# EAGLE design esp8266-hw7 (EAGLE 9.3.1)
ESP8266 HW
CNAME: Sensorboard; CREVISION: HW7; DESIGNER: Pär Sundbäck
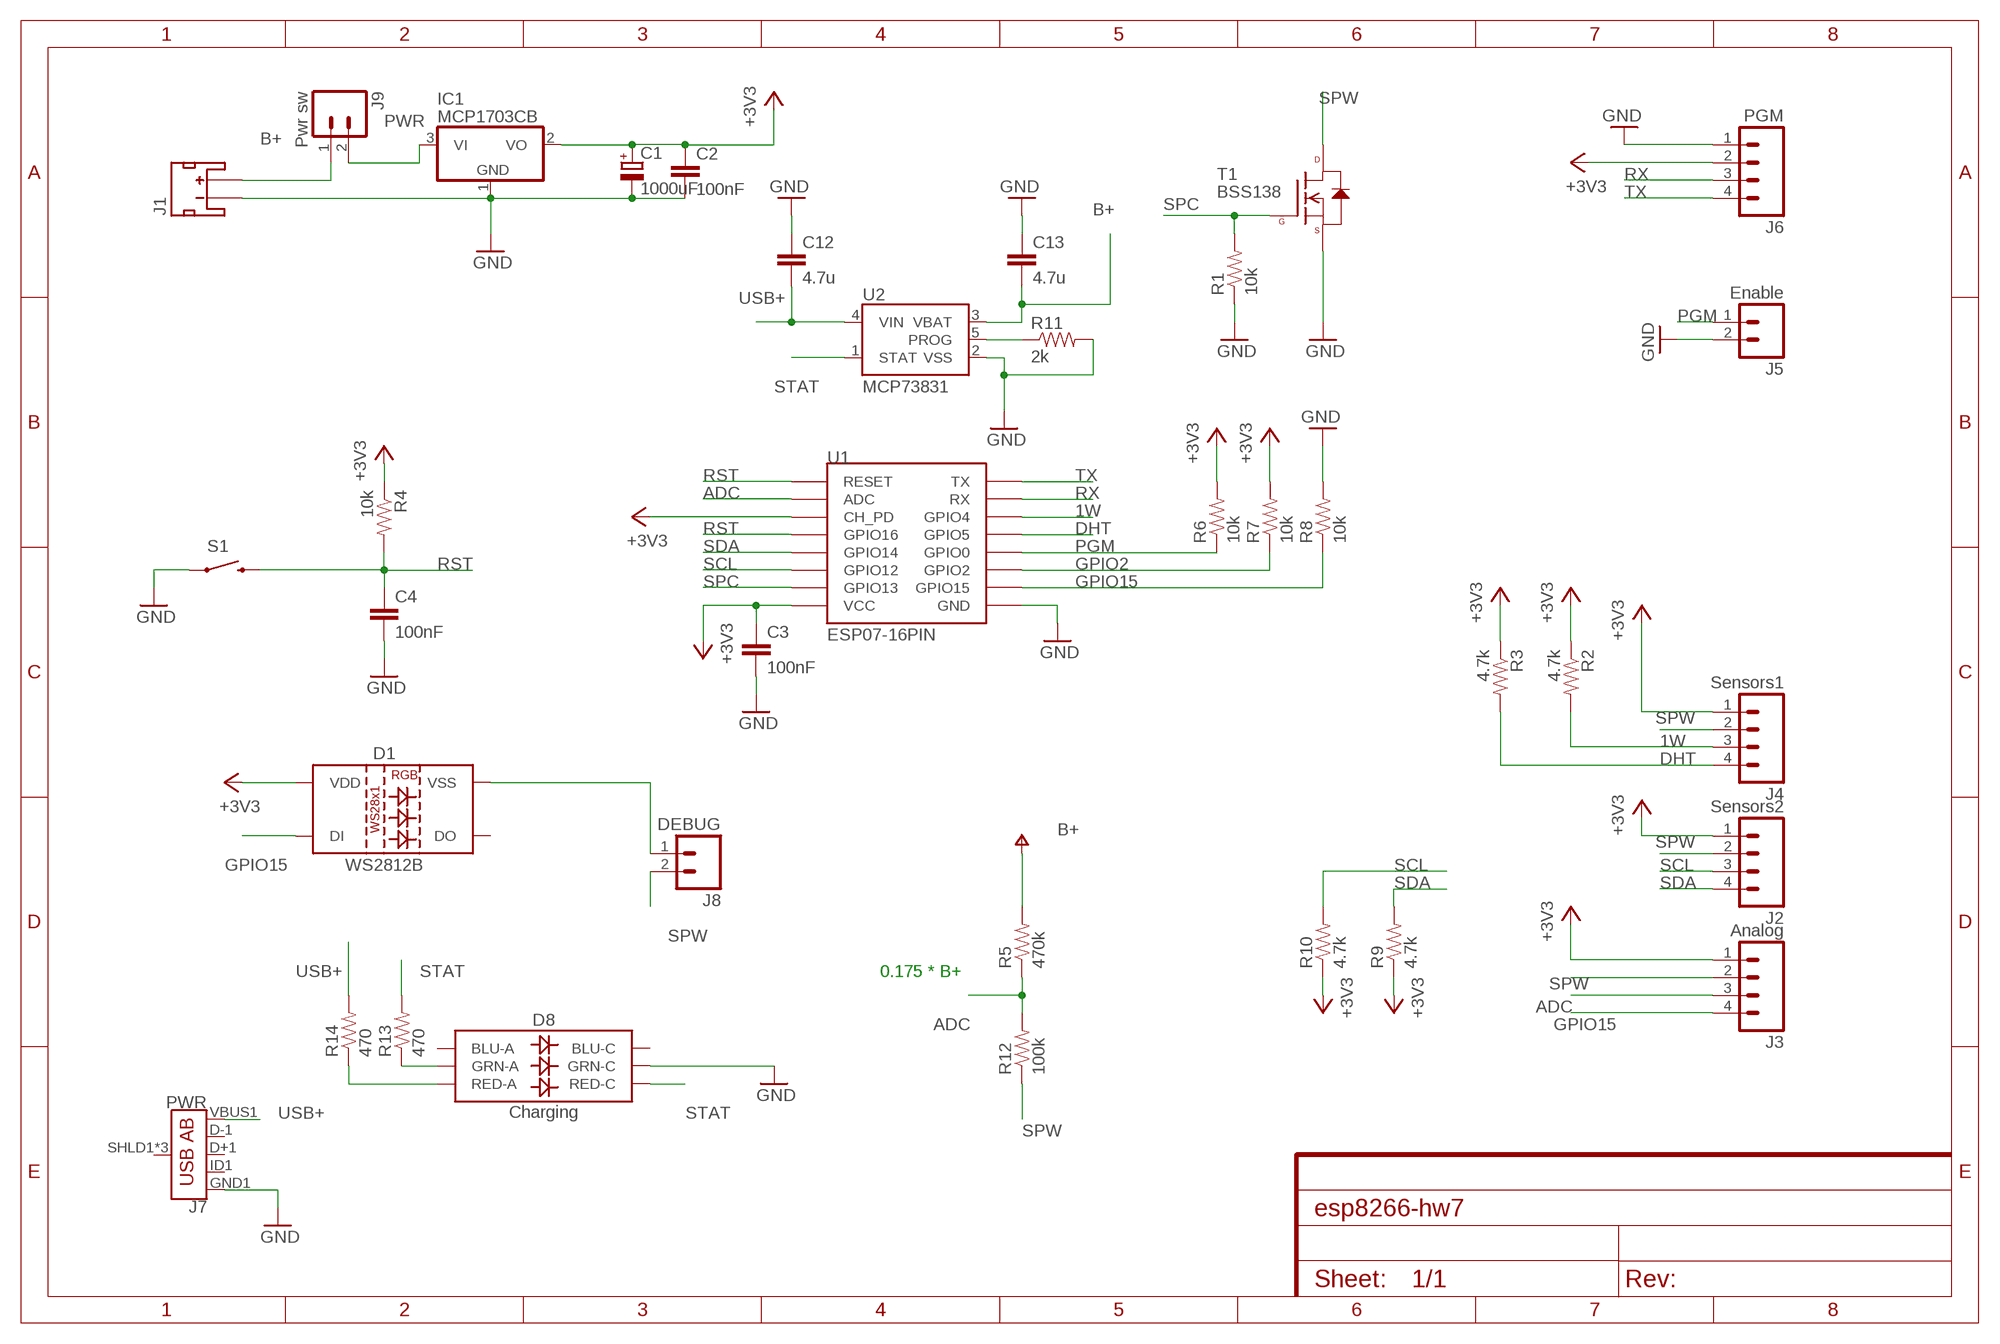
[diagram p0: schematic, sheet 1]

## Parts
C1  1000uF  CPOL-EUE3.5-8  [E3,5-8]
C2  100nF  CAP0805  [0805]
C3  100nF  CAP0805  [0805]
C4  100nF  CAP0805  [0805]
C12  4.7u  CAP0805  [0805]
C13  4.7u  CAP0805  [0805]
D1  WS2812B  [WS2812B]
D8  Charging  LED-RGBNO_IC  [LED-TRICOLOR-5050]
IC1  MCP1703CB  [SOT23]
J1  J1  JST_2MM_MALE  [JST-2-SMD]
J2  Sensors2  M04PTH  [1X04]
J3  Analog  M04PTH  [1X04]
J4  Sensors1  M04PTH  [1X04]
J5  Enable  M02PTH  [1X02]
J6  PGM  M04PTH  [1X04]
J7  PWR  USB_AB_SMT  [USB-AB-MICRO-SMD]
J8  DEBUG  M02PTH  [1X02]
J9  Pwr sw  M02PTH  [1X02]
R1  10k  RESISTOR0805-RES  [0805]
R2  4.7k  RESISTOR0805-RES  [0805]
R3  4.7k  RESISTOR0805-RES  [0805]
R4  10k  RESISTOR0805-RES  [0805]
R5  470k  RESISTOR0805-RES  [0805]
R6  10k  RESISTOR0805-RES  [0805]
R7  10k  RESISTOR0805-RES  [0805]
R8  10k  RESISTOR0805-RES  [0805]
R9  4.7k  RESISTOR0805-RES  [0805]
R10  4.7k  RESISTOR0805-RES  [0805]
R11  2k  RESISTOR0805-RES  [0805]
R12  100k  RESISTOR0805-RES  [0805]
R13  470  RESISTOR0805-RES  [0805]
R14  470  RESISTOR0805-RES  [0805]
S1  RESET  SWITCH-MOMENTARY-2SMD-1101NE  [TACTILE-SWITCH-1101NE]
T1  BSS138  N-CHANNEL-MOSFET-BSS138  [SOT23-3]
U1  ESP07-16PIN  [ESP07-16PIN]
U2  MCP73831  [SOT23-5]

## Nets
1W: J4.3 R2.2 U1.GPIO4
+3V3: C1.+ C2.1 C3.1 D1.1(VDD) IC1.2(VO) J2.1 J3.1 J4.1 J6.2 R2.1 R3.1 R4.1 R6.2 R7.2 R9.1 R10.1 U1.CH_PD U1.VCC
ADC: J3.3 R5.1 R12.2 U1.ADC
B+: C13.2 J1.2(+) J9.1 R5.2 U2.3(VBAT) ; supply symbol labelled V+
DHT: J4.4 R3.2 U1.GPIO5
GND: C1.- C2.2 C3.2 C4.2 C12.1 C13.1 D8.6(GRN-C) IC1.1(GND) J1.1(-) J5.2 J6.1 J7.GND1(GND) R1.1 R8.2 R11.2 S1.1 T1.2(S) U1.GND U2.2(VSS)
GPIO2: R7.1 U1.GPIO2
GPIO15: D1.4(DI) J3.4 R8.1 U1.GPIO15
N$2: D8.1(GRN-A) R13.1
N$6: D1.3(VSS) J8.1
N$8: D8.2(RED-A) R14.1
N$10: R11.1 U2.5(PROG)
PGM: J5.1 R6.1 U1.GPIO0
PWR: IC1.3(VI) J9.2
RST: C4.1 R4.2 S1.2 U1.GPIO16 U1.REST(RESET)
RX: J6.3 U1.RX
SCL: J2.3 R10.2 U1.GPIO12
SDA: J2.4 R9.2 U1.GPIO14
SPC: R1.2 T1.1(G) U1.GPIO13
SPW: J2.2 J3.2 J4.2 J8.2 R12.1 T1.3(D)
STAT: D8.5(RED-C) R13.2 U2.1(STAT)
TX: J6.4 U1.TX
USB+: C12.2 J7.VBUS1(VBUS) R14.2 U2.4(VIN)
Unconnected: D1.2(DO) D8.3(BLU-A) D8.4(BLU-C) J1.NC1(PAD1) J1.NC2(PAD2) J7.D+1(D+) J7.D-1(D-) J7.ID1(USBID) J7.SHLD1(SHIELD) J7.SHLD2(SHIELD) J7.SHLD3(SHIELD)

## Notes on the sheet
- 0.175 * B+

## Library data of the parts
C1 = rcl:CPOL-EU: POLARIZED CAPACITOR, European symbol; SPICEPREFIX: C
C2-C4 C12 C13 = SparkFun-Passives:CAP: Capacitor Standard 0603 ceramic capacitor, and 0.1" leaded capacitor.
D1 = SparkFun-LED:WS2812B: WS2812B SMD addressable RGB LED 5x5mm SMD LED with built-in controller IC. Color: Red/Green/Blue mC Rating: RGB: 390, 660, 180 mcd Forward Voltage: RGB: 2.0, 3.0, 3.0 V Packages:WS2812B SparkFun Products: Blynk Board - ESP8266 <https://www.sparkfun.com/products/13794>; PROD_ID: DIO-12503
D8 = SparkFun-LED:LED-RGB: LED-RGB 6 pin RGB LED (no common connector) Packages: PLCC-6 LED-TRICOLOR-5050 - No built-in IC SparkFun Products: Digital Sandbox <https://www.sparkfun.com/products/12651> LED- SMD RGB <https://www.sparkfun.com/products/10866>; PROD_ID: DIO-10298
IC1 = linear:MCP1703: 250 mA, 16V, Low Quiescent Current LDO Regulator Source: http://ww1.microchip.com/downloads/en/DeviceDoc/22049b.pdf
J1 = SparkFun-Connectors:JST_2MM_MALE: Mates to single-cell LiPo batteries. CONN-11443 Now with smashable polarity marks!; BTM_NEG: -; BTM_POS: +; PROD_ID: CONN-11443; TOP_NEG: -; TOP_POS: +
J2-J4 J6 = SparkFun-Connectors:M04: Header 4 Standard 4-pin 0.1" header. Use with straight break away headers (SKU : PRT-00116), right angle break away headers (PRT-00553), swiss pins (PRT-00743), machine pins (PRT-00117), and female headers (PRT-00115). Molex polarized connector foot print use with SKU : PRT-08231 with associated crimp pins and housings. 1MM SMD Version SKU: PRT-10208; PROD_ID: CONN-09696
J5 J8 J9 = SparkFun-Connectors:M02: Standard 2-pin 0.1" header. Use with - straight break away headers ( PRT-00116) - right angle break away headers (PRT-00553) - swiss pins (PRT-00743) - machine pins (PRT-00117) - female headers (PRT-00115) Molex polarized connector foot print use with: PRT-08233 with associated crimp pins and housings. 2.54_SCREWTERM for use with PRT-10571. 3.5mm Screw Terminal footprints for PRT-08084 5mm Screw Terminal footprints for use with PRT-08432
J7 = SparkFun-Connectors:USB_AB: USB Type AB Micro Connector OTG-compatible. 5 pins, 3 shield pins SparkFun Products: IOIO-OTG <https://www.sparkfun.com/products/13613> SparkFun SAMD21 Mini Breakout <https://www.sparkfun.com/products/13664>; PROD_ID: CONN-11794
R1-R14 = SparkFun-Resistors:RESISTOR: Resistor Basic schematic elements and footprints for 0603, 1206, and PTH resistors.
S1 = SparkFun-Electromechanical:SWITCH-MOMENTARY-2: Various NO switches- pushbuttons, reed, etc; PROD_ID: SWCH-00815
T1 = GeekAmmo:N-CHANNEL-MOSFET: N-Channel MOSFET Mode Field Effect Transistor; DATASHEET: http://www.fairchildsemi.com/ds/BS/BSS138.pdf; DIGIKEY: BSS138TR-ND; ELEMENT14: 2323154; URL: http://au.element14.com/fairchild-semiconductor/bss138/mosfet-n-ch-50v-220ma-sot-23/dp/2323154
U1 = esp8266modules:ESP07-16PIN: ESP8266 Wifi module 07 - 16 pins; DIMENSIONS: 22.0 x 16.0 mm; PINS: 16; PITCH: 0.078" / 2 mm
U2 = SparkFun-IC-Power:MCP73831: MCP73831T Li-Ion, Li-Pol Controller Miniature single cell, fully integrated Li-Ion, Li-polymer charge management controller Datasheet <http://ww1.microchip.com/downloads/en/DeviceDoc/20001984g.pdf> SparkFun Products: SparkFun ESP32 Thing <https://www.sparkfun.com/products/13907> SparkFun 9DoF Razor IMU M0 <https://www.sparkfun.com/products/14001>; PROD_ID: IC-09995

## Board
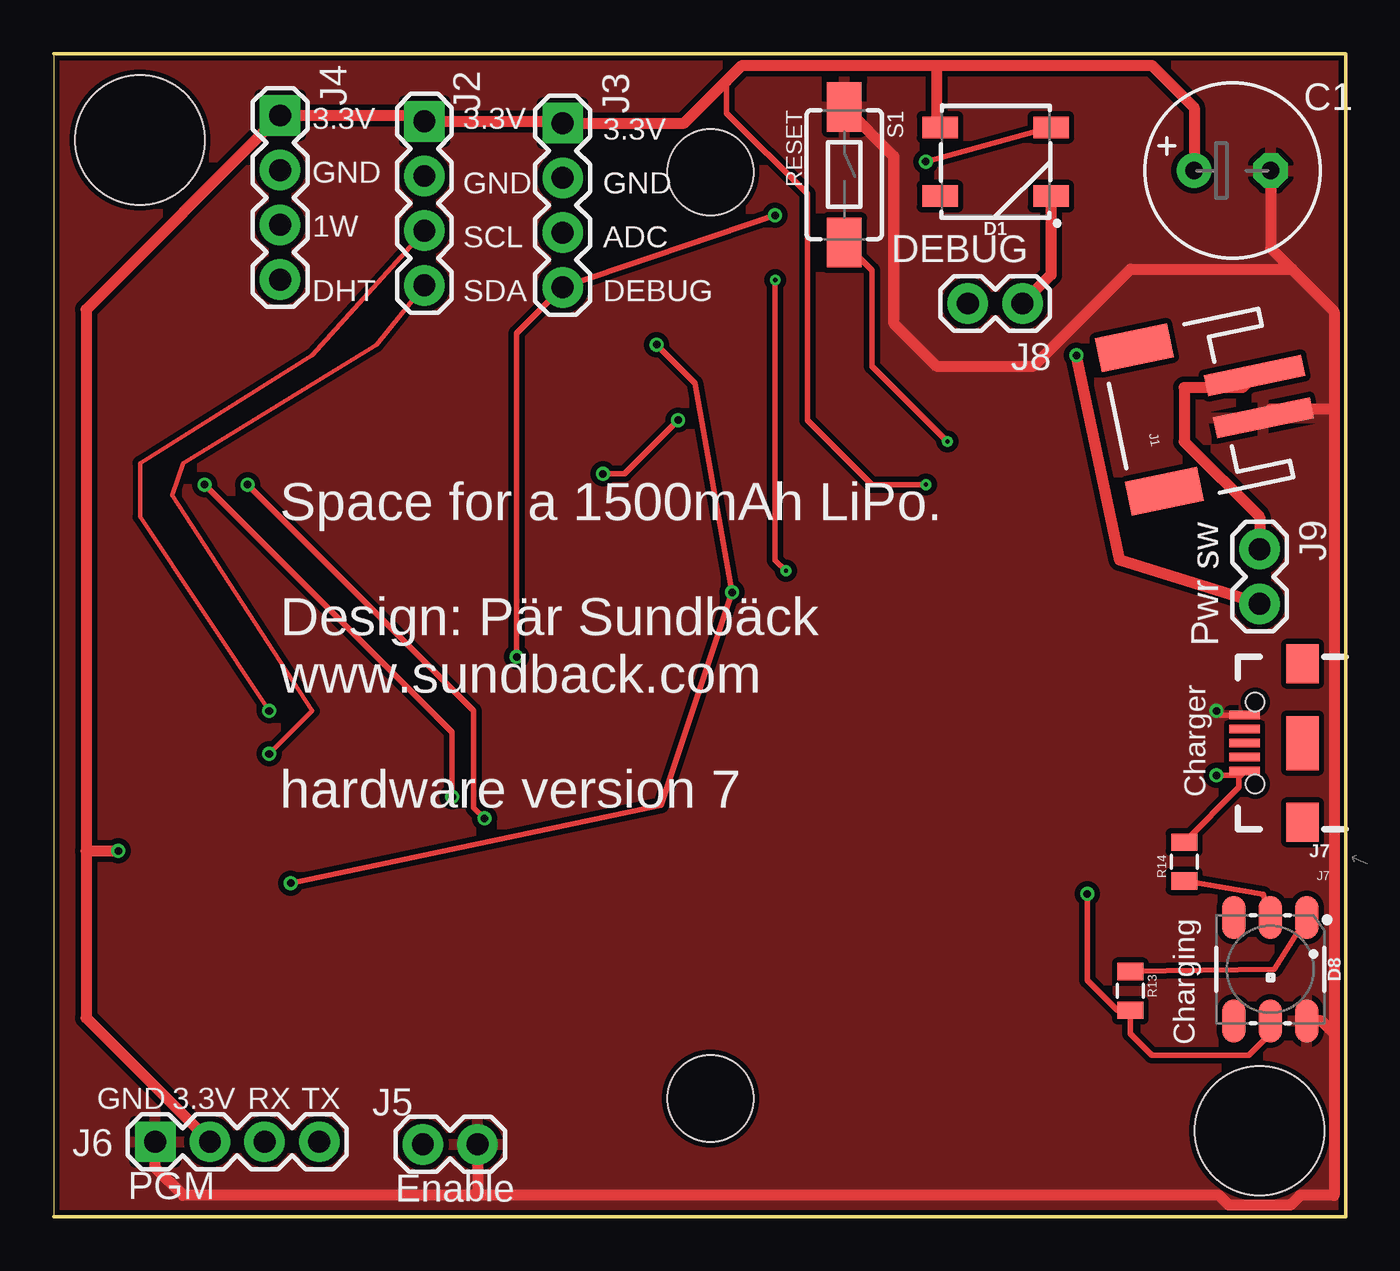
[diagram p1: board, top side]
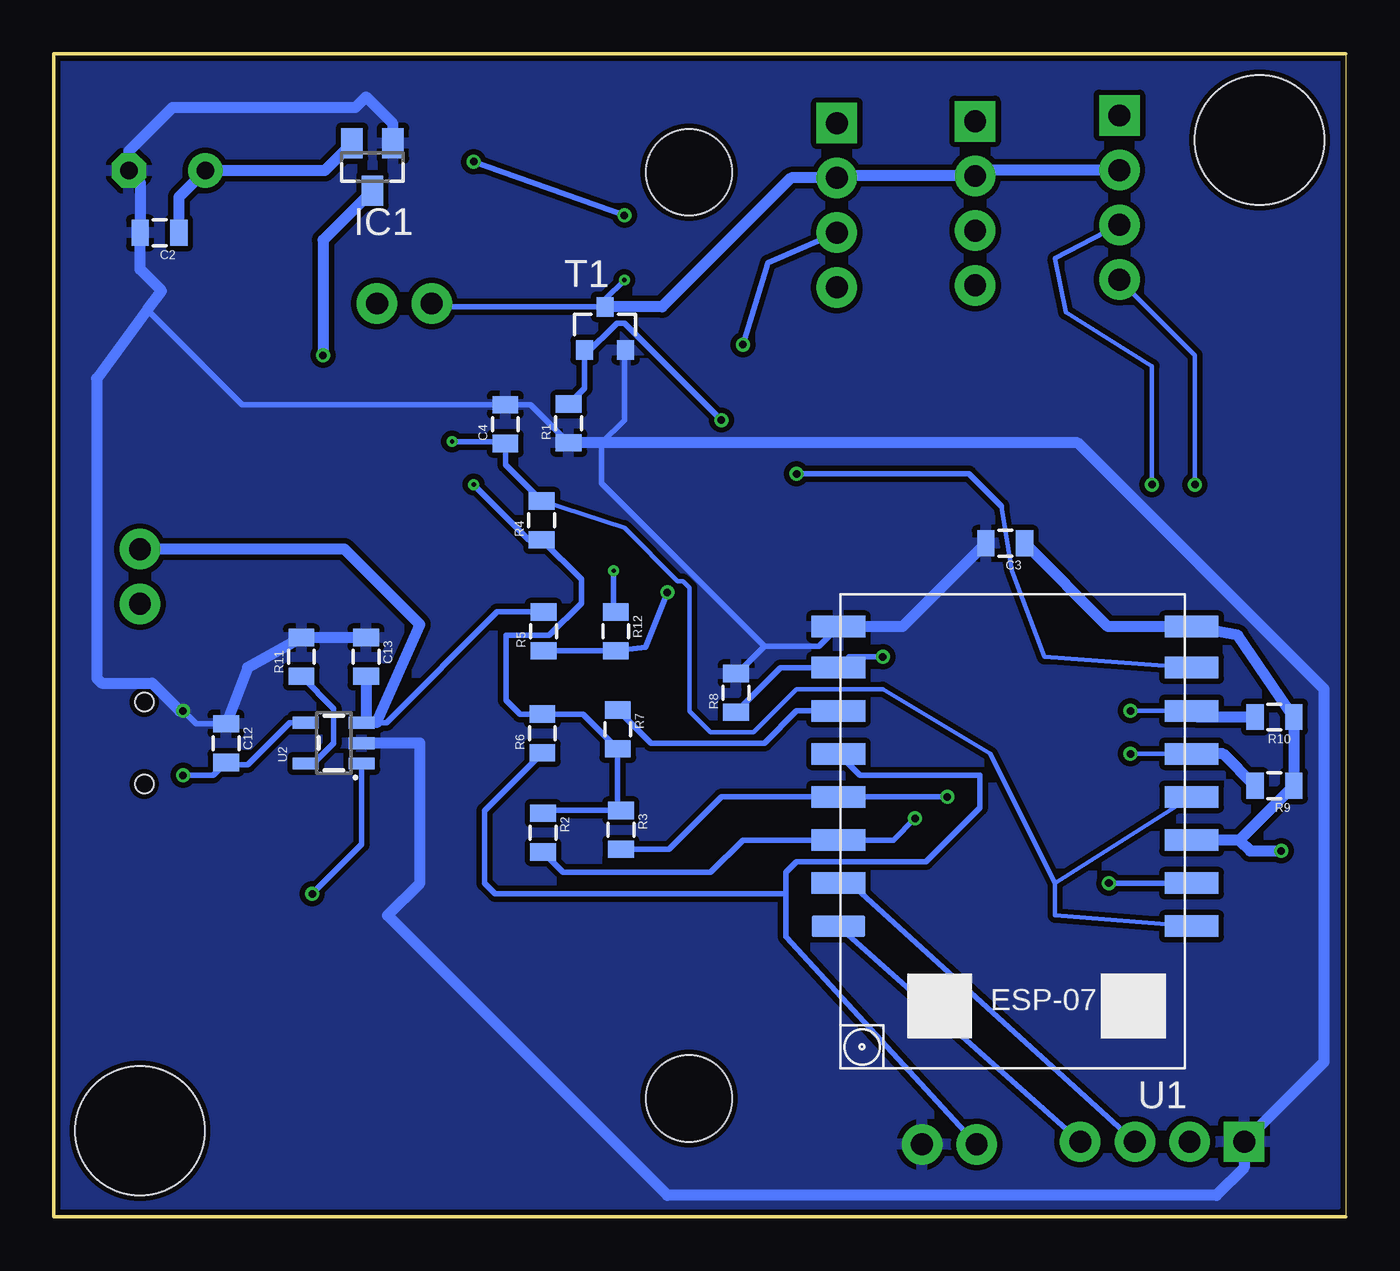
[diagram p2: board, bottom side, seen from below]

Size 60 x 54 mm. Coordinates in mm from the lower left corner, seen from the top.
Outline: 0,54 0,0 60,0 60,54 0,54
Copper layers (1*16): Top 0.035mm / dielectric 1.5mm / Bottom 0.035mm
Design rules "aisler_2_layer": minimum track width 0.1mm, minimum drill 0.2mm, track to track 0.1mm, track to pad 0.1mm, pad to pad 0.1mm, via to via 0.1mm, smd to smd 0.1mm, copper to edge 0.2mm, drill to drill 0.21mm, minimum pad ring 0.25mm, minimum via ring 0.15mm, stop-mask expansion 0mil, vias tented up to drill 0mil, thermal gap 10mil
Holes 6 mm at 4,50 56,4
Holes 4 mm at 30.5,5.5 30.5,48.5

### Footprints (pad centres in the part's own frame; a part is rotated, then mirrored left to right if it is on the bottom)
E3,5-8 = drill 0.813 pad 1.6: + -1.778,0 | drill 0.813 pad 1.6 octagon: - 1.778,0
0805 = smd 0.8 x 1.2: 1 -0.9,0; 2 0.9,0
WS2812B = smd 1.651 x 1: 1 2.577,-1.6; 2 2.577,1.6; 3 -2.577,1.6; 4 -2.577,-1.6
LED-TRICOLOR-5050 = smd 2 x 1.1: 1 -2.4,1.7; 2 -2.4,0; 3 -2.4,-1.7; 4 2.4,-1.7; 5 2.4,0; 6 2.4,1.7
SOT23 = smd 1 x 1.4: 1 -0.95,-1.1; 2 0.95,-1.1; 3 0,1.1
JST-2-SMD = smd 1 x 4.6: 1 -1,-3.7; 2 1,-3.7 | smd 1.6 x 3.4: NC1 -3.4,1.5; NC2 3.4,1.5
1X04 = drill 1.016 pad 1.88 square: 1 0,0 | drill 1.016 pad 1.88: 2 2.54,0; 3 5.08,0; 4 7.62,0
1X02 = drill 1.016 pad 1.88: 1 0,0; 2 2.54,0
USB-AB-MICRO-SMD = smd 1.4 x 0.4: D+1 2.7,0; D-1 2.7,0.65; GND1 2.7,-1.3; ID1 2.7,-0.65; VBUS1 2.7,1.3 | smd 1.5 x 1.8: SHLD1 0,-3.68; SHLD2 0,3.68 | smd 1.5 x 2.5: SHLD3 0,0 | hole 0.85: 2.2,1.9; 2.2,-1.9
TACTILE-SWITCH-1101NE = smd 2.3 x 1.6: 1 -3.15,0; 2 3.15,0
SOT23-3 = smd 0.8 x 0.9: 1 -0.95,-1; 2 0.95,-1; 3 0,1
ESP07-16PIN = smd 2.5 x 1: ADC -8.2,3.8; CH_PD -8.2,1.8; GND 8.2,-8.105; GPIO0 8.2,-2.2; GPIO2 8.2,-4.2; GPIO4 8.2,1.8; GPIO5 8.2,-0.2; GPIO12 -8.2,-4.2; GPIO13 -8.2,-6.2; GPIO14 -8.2,-2.2; GPIO15 8.2,-6.2; GPIO16 -8.2,-0.2; REST -8.2,5.8; RX 8.2,3.8; TX 8.2,5.8; VCC -8.2,-8.105
SOT23-5 = smd 0.55 x 1.2: 1 -0.95,-1.3; 2 0,-1.3; 3 0.95,-1.3; 4 0.95,1.3; 5 -0.95,1.3

### Placement (x,y rotation side)
C1  54.74,48.58 0 top
C2  55.09,45.69 180 bottom
C3  15.81,31.28 180 bottom
C4  39.03,36.81 90 bottom
C12  52,22 270 bottom
C13  45.5,26 270 bottom
D1  43.74,48.99 180 top
D8  56.5,11.5 270 top
IC1  45.2,48.75 180 bottom
J1  52.35,37.33 101.8 top
J2  17.21,50.87 270 top
J3  23.63,50.78 270 top
J4  10.51,51.14 270 top
J5  17.14,3.37 0 top
J6  4.71,3.49 0 top
J7  58,22 180 top
J8  44.99,42.41 180 top
J9  56,31 270 top
R1  36.09,36.84 90 bottom
R2  37.28,17.84 270 bottom
R3  33.66,17.97 270 bottom
R4  37.34,32.34 90 bottom
R5  37.26,27.19 90 bottom
R6  37.31,22.45 90 bottom
R7  33.81,22.64 270 bottom
R8  28.31,24.33 90 bottom
R9  3.31,20.02 180 bottom
R10  3.31,23.21 180 bottom
R11  48.5,26 90 bottom
R12  33.9,27.19 270 bottom
R13  50,10.5 270 top
R14  52.5,16.5 90 top
S1  36.71,48.39 270 top
T1  34.4,41.25 0 bottom
U1  15.36,19.3 180 bottom
U2  47,22 90 bottom

### Tracks (layer width: path | path; a pad name or v marks a point on that pad's centre or on a via)
1W  (via drill 0.35)
  Top 0.254: v20,18.5 19.5,19 19.5,23.5 v9,34
  Bottom 0.2: v9,34 9,39.5 13,42 13.5,44.5 J4.3
  Bottom 0.254: R2.2 36.34,16 29.5,16 28,17.5 U1.GPIO4 21,17.5 v20,18.5
+3V3  (via drill 0.2, 0.35)
  Top 0.254: 31.25,52.75 31.25,51.25 35,47.5 35,37 38,34 v40.5,34
  Top 0.508: 41,53.47 31.97,53.47 31.25,52.75 29.28,50.78 J3.1 23.54,50.87 J2.1 16.94,51.14 J4.1 1.5,42.13 1.5,17 | 41,53.47 51,53.47 52.96,51.51 C1.+ | J6.2 1.5,9.24 1.5,17 | 41,53.47 41,50.75 D1.1 | 1.5,17 v3,17
  Bottom 0.254: R2.1 37.15,18.87 R3.1 33.81,19.02 R7.2 35.42,23.35 R6.2 38.35,23.35 39,24 39,27 37,27 35.5,28.5 35.5,29.6 R4.1 37.94,31.44 v40.5,34
  Bottom 0.508: C2.1 54.19,47.35 C1.+ 47.42,48.58 IC1.2 | 4.93,17.5 R9.1 R10.1 5,27 U1.VCC 11.04,27.41 C3.1 | 4.93,17.5 U1.CH_PD | 4.93,17.5 4.43,17 v3,17
ADC  (via drill 0.35)
  Top 0.254: v11,15.5 28.21,19.12 v31.5,29 29.79,38.71 v28,40.5
  Bottom 0.254: R5.1 R12.2 32.52,26.44 v31.5,29 | U1.ADC v11,15.5 | J3.3 26.83,44.29 v28,40.5
B+
  Top 0.508: J1.2 55.2,38.5 52.5,38.5 52.5,36 56,32.5 J9.1
  Bottom 0.254: U2.3 45.5,22.95 45,22.95 44.55,22.95 39.41,28.09 R5.2
  Bottom 0.508: 45,22.95 43,27.5 46.5,31 J9.1 | C13.2 45.5,22.95
DHT  (via drill 0.35)
  Top 0.254: v7,34 18.5,22.5 v18.5,19.5
  Bottom 0.2: J4.4 7,40.01 v7,34
  Bottom 0.254: R3.2 31.43,17.07 29,19.5 U1.GPIO5 v18.5,19.5
GND  (via drill 0.35)
  Top 0.254: J7.GND1 54.2,23.3 v54,23.5
  Top 0.508: C1.- 56.52,44.98 57.5,44 | 57.5,44 59.47,42.03 59.47,37.5 | 59.47,37.5 56.5,37.5 56.5,37.43 J1.1 | 59.47,37.5 59.47,8.5 | 59.47,8.5 58.87,9.1 D8.6 | 59.47,8.5 59.47,1 57.88,1 57.43,0.55 54.57,0.55 54.12,1 19.5,1 | 19.5,1 6,1 4.71,2.29 J6.1 | J5.2 19.68,1.18 19.5,1 | S1.1 39,49.25 39,41.5 41,39.5 45.5,39.5 50,44 57.5,44
  Bottom 0.254: v54,23.5 53.4,22.9 C12.1 | U1.GND 24.46,26.5 27,26.5 | 27,26.5 28.27,25.23 R8.2 | 55.66,42.11 51.25,37.71 C4.2 37.86,37.71 R1.1 34.56,35.94 | T1.2 33.5,40.2 33.5,37 34.56,35.94 | 27,26.5 34.56,34.06 34.56,35.94
  Bottom 0.508: C3.2 20.59,27.41 U1.GND | IC1.1 44.25,50.75 45.5,52 46,51.5 54.5,51.5 56.52,49.48 C1.- 55.99,48.05 C2.2 55.99,43.99 55,43 55.66,42.11 58.02,38.92 58,25 57.78,24.78 55.44,24.78 54.16,23.5 v54,23.5 | U2.2 43,22 43,15.5 44.5,14 31.5,1 6,1 4.71,2.29 J6.1 1,7.2 1,24.5 12.44,35.94 R1.1 | C13.1 R11.2 51,25.5 C12.1
  pour Bottom (isolate 0.254): 0,54 0,1 0.5,0.5 1,0 60,0 60,54
  pour Top (isolate 0.254): 0,54 0,0 60,0 60,53.5 59.5,54
GPIO2
  Bottom 0.254: R7.1 32.27,22 27,22 25.5,23.5 U1.GPIO2
GPIO15  (via drill 0.35)
  Top 0.254: v33.5,46.5 J3.4 21.5,41.03 v21.5,26 | D1.4 v40.5,49
  Bottom 0.254: R8.1 26.24,25.5 U1.GPIO15 23.06,26 v21.5,26 | v33.5,46.5 v40.5,49
N$2
  Top 0.254: D8.1 56.68,11.49 R13.1
N$6
  Top 0.508: D1.3 46.32,43.74 J8.1
N$8
  Top 0.254: R14.1 56.16,14.97 D8.2
N$10
  Bottom 0.254: R11.1 47,23.6 47,22 47.95,21.05 U2.5
PGM
  Bottom 0.254: J5.1 26,13 26,15 | 26,15 26,16 25.5,16.5 19.5,16.5 17,19 17,20.5 22.56,20.5 U1.GPIO0 | R6.1 40,18.86 40,15.5 39.5,15 26,15
PWR  (via drill 0.35)
  Top 0.508: J9.2 49.5,30.5 v47.5,40
  Bottom 0.508: IC1.3 47.5,45.35 v47.5,40
RST  (via drill 0.2)
  Top 0.254: S1.2 38,43.95 38,39.5 v41.5,36
  Bottom 0.2: U1.GPIO16 13.5,15.5 | 13.5,15.5 13.5,14 U1.REST | 13.5,15.5 16.5,21.5 21.5,24.5 25.5,24.5 27.5,22.5 29.5,22.5 30.48,23.48 30.48,29.22 30.78,29.52 31.02,29.52 33.5,32 R4.2
  Bottom 0.254: R4.2 39.03,34.93 C4.1 39.12,36 v41.5,36
RX
  Bottom 0.254: J6.3 23,15.5 U1.RX
SCL  (via drill 0.35)
  Top 0.2: J2.3 12,40 4,35 4,32.5 v10,23.5
  Bottom 0.2: U1.GPIO12 v10,23.5
  Bottom 0.508: R10.2 6.87,23.21 U1.GPIO12
SDA  (via drill 0.35)
  Top 0.2: v10,21.5 12,23.5 5.5,33.5 6,35 15,40.5 J2.4
  Bottom 0.2: U1.GPIO14 v10,21.5
  Bottom 0.508: R9.2 5.69,21.5 U1.GPIO14
SPC  (via drill 0.35)
  Top 0.254: v25.5,34.5 26.5,34.5 v29,37
  Bottom 0.2: U1.GPIO13 14,26 15.5,30 16,33
  Bottom 0.254: R1.2 35.35,38.48 35.35,40 | 35.35,40 T1.1 | 16,33 17.5,34.5 v25.5,34.5 | v29,37 33.5,41.5 33.85,41.5 35.35,40
SPW  (via drill 0.2)
  Top 0.254: v33.5,43.5 33.5,30.5 v34,30
  Bottom 0.254: J8.2 42.29,42.25 T1.3 34.4,42.6 v33.5,43.5 | R12.1 34,28.19 v34,30
  Bottom 0.508: J4.2 16.94,48.6 J2.2 23.54,48.33 J3.2 25.76,48.24 31.75,42.25 T1.3
STAT  (via drill 0.35)
  Top 0.254: v48,15 48,11 49.4,9.6 R13.2 50,8.5 51,7.5 55.5,7.5 56.5,8.5 D8.5
  Bottom 0.254: U2.1 45.7,17.3 v48,15
TX
  Bottom 0.254: U1.TX J6.4
USB+  (via drill 0.35)
  Top 0.254: R14.2 55.05,19.95 55.05,20.41 55.3,20.66 J7.VBUS1 55.1,20.5 v54,20.5
  Bottom 0.254: U2.4 49.05,22.95 51,21 51.9,21 C12.2 52.6,20.5 v54,20.5

### Text on the board
tNames: 3.3V | 3.3V | 3.3V | GND | GND | GND | 1W | SCL | ADC | DHT | SDA | DEBUG | Charger | Space for a 1500mAh LiPo. / / Design: Pär Sundbäck / www.sundback.com / / hardware version 7 | Charging | GND | 3.3V | RX | TX